# Altium schematic sheet LCD1602接线模块.SCHDOC
size A4
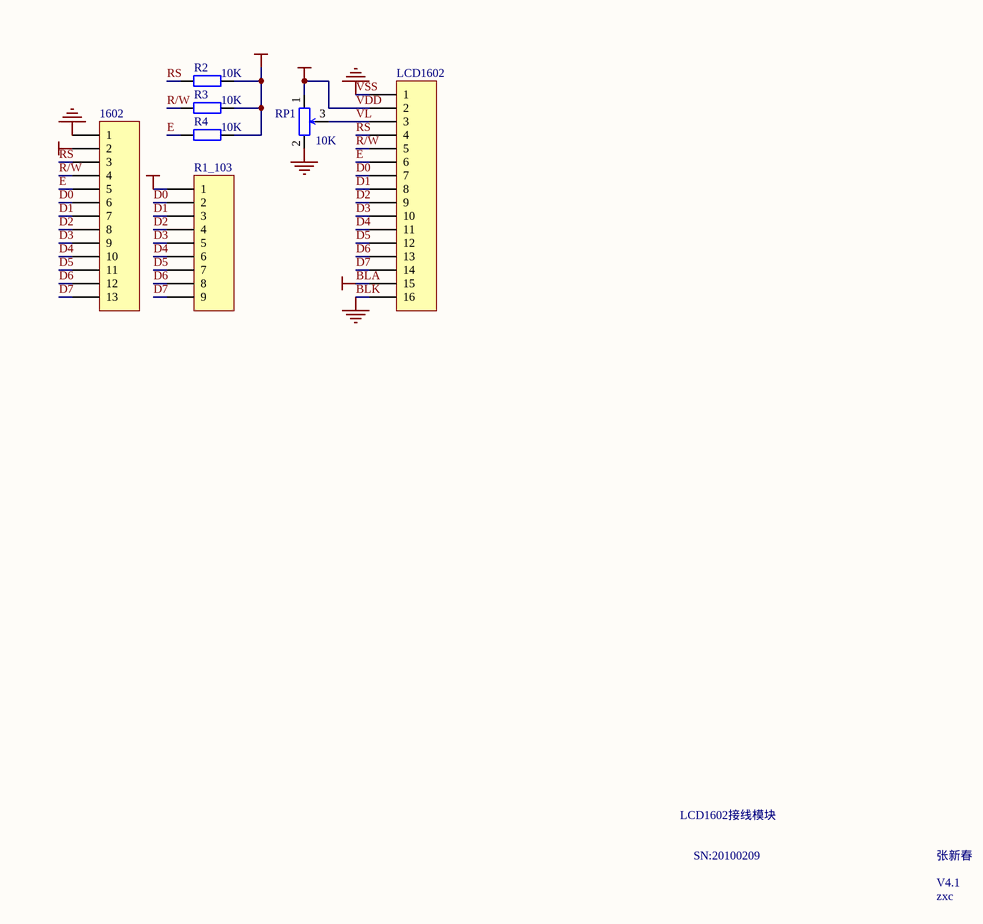
[diagram p0: LCD1602接线模块.SCHDOC]

## Parts
1602  Header 13  [HDR1X13]  (value not drawn)
LCD1602  Header 16  [HDR1X16]  (value not drawn)
R1_103  Header 9  [HDR1X9]  (value not drawn)
R2  value 10K  [TP-0805-R]  (hidden comment: Res)
R3  value 10K  [TP-0805-R]  (hidden comment: Res)
R4  value 10K  [TP-0805-R]  (hidden comment: Res)
RP1  value 10K  [SIP3-D]  (hidden comment: Res _JT)

## Nets
BLA: 1602.2 LCD1602.2 LCD1602.15 R1_103.1 R2.2 R3.2 R4.2 RP1.1  [also labelled VCC, VDD]
BLK: 1602.1 LCD1602.1 LCD1602.16 RP1.2  [also labelled GND, VSS]
D0: 1602.6 LCD1602.7 R1_103.2
D1: 1602.7 LCD1602.8 R1_103.3
D2: 1602.8 LCD1602.9 R1_103.4
D3: 1602.9 LCD1602.10 R1_103.5
D4: 1602.10 LCD1602.11 R1_103.6
D5: 1602.11 LCD1602.12 R1_103.7
D6: 1602.12 LCD1602.13 R1_103.8
D7: 1602.13 LCD1602.14 R1_103.9
E: 1602.5 LCD1602.6 R4.1
R/W: 1602.4 LCD1602.5 R3.1
RS: 1602.3 LCD1602.4 R2.1
VL: LCD1602.3 RP1.3

## Notes on the sheet
- LCD1602接线模块
- SN:20100209
- 张新春
- V4.1
- zxc

## Library data of the parts
1602 = Header 13: Header, 13-Pin; LatestRevisionDate: 17-Jul-2002; LatestRevisionNote: Re-released for DXP Platform.; Publisher: Altium Limited
LCD1602 = Header 16: Header, 16-Pin; LatestRevisionDate: 17-Jul-2002; LatestRevisionNote: Re-released for DXP Platform.; Publisher: Altium Limited
R1_103 = Header 9: Header, 9-Pin; LatestRevisionDate: 17-Jul-2002; LatestRevisionNote: Re-released for DXP Platform.; Publisher: Altium Limited
R2-R4 = Res: 电阻; Published: 8-Jun-2000; LatestRevisionDate: 17-Jul-2002; LatestRevisionNote: Re-released for DXP Platform.; Publisher: Altium Limited
RP1 = Res _JT: j精调电阻; Set Position: 0.5; Published: 8-Jun-2000; LatestRevisionDate: 17-Jul-2002; LatestRevisionNote: Re-released for DXP Platform.; Publisher: Altium Limited